# Altium project Diff_Pressure_Sensors.PrjPcb
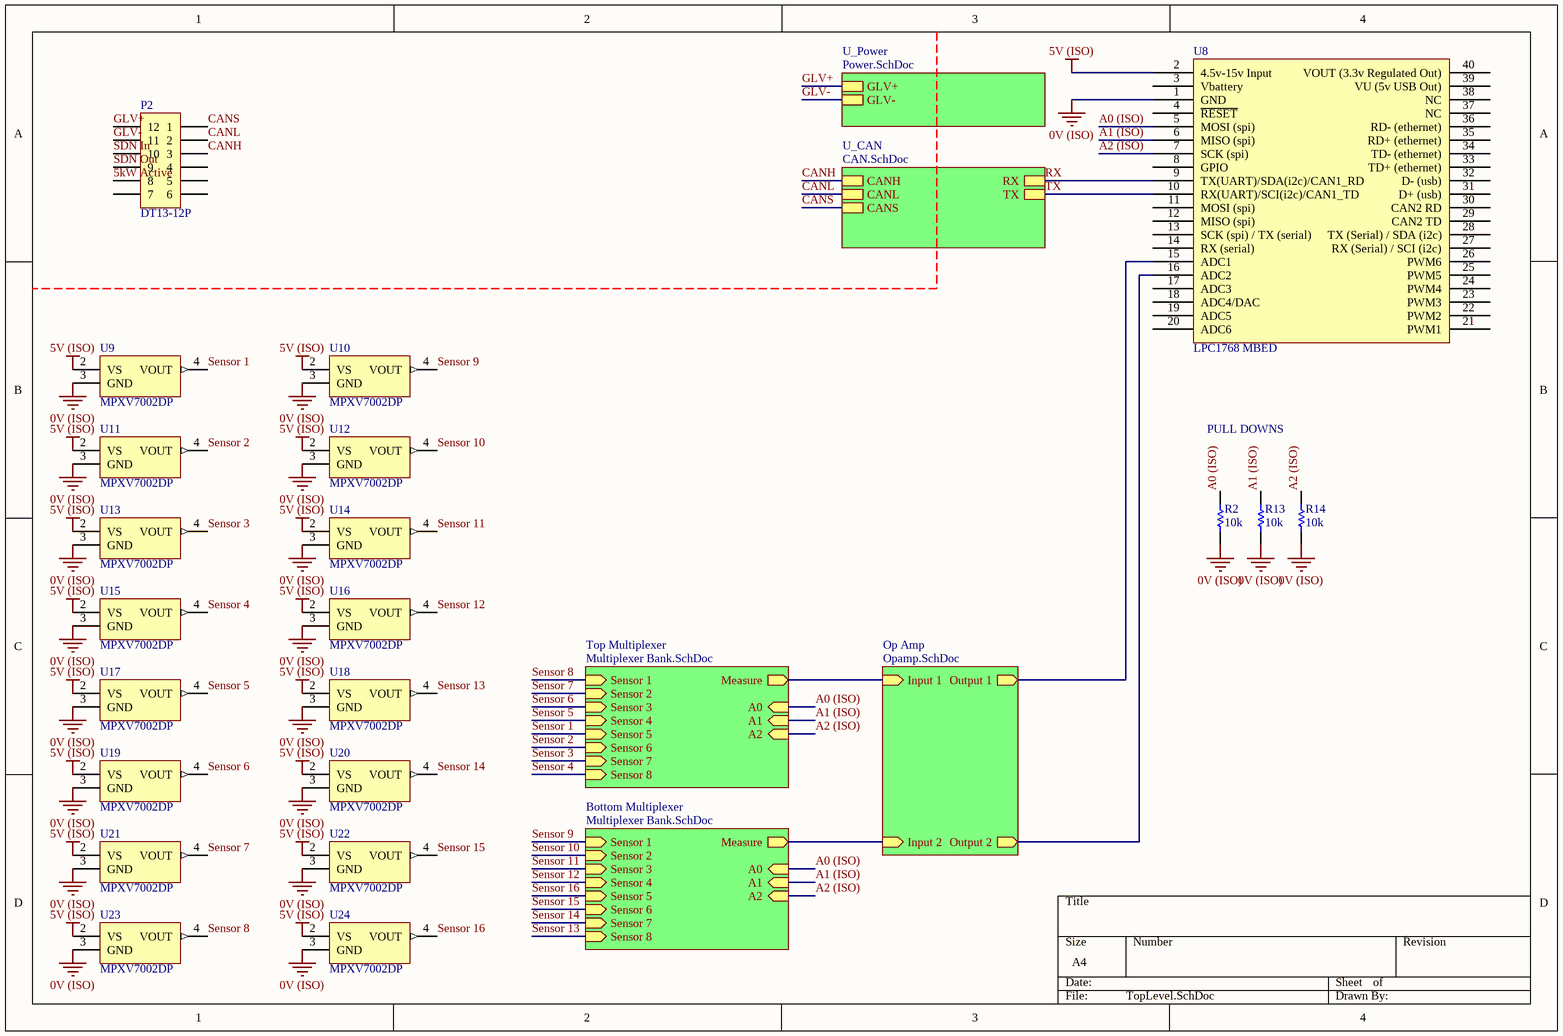
[diagram p0: TopLevel.SchDoc]
5 sheets, 73 parts. Net scope: hierarchical (ports join the sheet entries above them; power ports are global).
Board files: 190830 Diff Pressure Sensors.PcbDoc, 190816 Diff Pressure Sensors.PcbDoc
Sheets:
  TopLevel.SchDoc
    U_Power = Power.SchDoc
    U_CAN = CAN.SchDoc
    Top Multiplexer = Multiplexer Bank.SchDoc
    Bottom Multiplexer = Multiplexer Bank.SchDoc
    Op Amp = Opamp.SchDoc

## Sheet TopLevel.SchDoc
size A4

### Parts
P2  DT13-12P  [DT13-12P]
R2  10k  [0805]
R13  10k  [0805]
R14  10k  [0805]
U8  LPC1768 MBED  [LPC1768 MBED]
U9  MPXV7002DP  [NXP 8-SOP]
U10  MPXV7002DP  [NXP 8-SOP]
U11  MPXV7002DP  [NXP 8-SOP]
U12  MPXV7002DP  [NXP 8-SOP]
U13  MPXV7002DP  [NXP 8-SOP]
U14  MPXV7002DP  [NXP 8-SOP]
U15  MPXV7002DP  [NXP 8-SOP]
U16  MPXV7002DP  [NXP 8-SOP]
U17  MPXV7002DP  [NXP 8-SOP]
U18  MPXV7002DP  [NXP 8-SOP]
U19  MPXV7002DP  [NXP 8-SOP]
U20  MPXV7002DP  [NXP 8-SOP]
U21  MPXV7002DP  [NXP 8-SOP]
U22  MPXV7002DP  [NXP 8-SOP]
U23  MPXV7002DP  [NXP 8-SOP]
U24  MPXV7002DP  [NXP 8-SOP]

### Sub-sheets
Bottom Multiplexer = Multiplexer Bank.SchDoc: Sensor 1 (in), Sensor 2 (in), Sensor 3 (in), Sensor 4 (in), Sensor 5 (in), Sensor 6 (in), Sensor 7 (in), Sensor 8 (in), A0 (in), A1 (in), A2 (in), Measure (out)
Op Amp = Opamp.SchDoc: Input 1 (in), Output 1 (out), Input 2 (in), Output 2 (out)
Top Multiplexer = Multiplexer Bank.SchDoc: Sensor 1 (in), Sensor 2 (in), Sensor 3 (in), Sensor 4 (in), Sensor 5 (in), Sensor 6 (in), Sensor 7 (in), Sensor 8 (in), A0 (in), A1 (in), A2 (in), Measure (out)
U_CAN = CAN.SchDoc: RX, TX, CANH, CANL, CANS
U_Power = Power.SchDoc: GLV+, GLV-

### Nets
0V (ISO): R2.1 R13.1 R14.1 U8.1(GND) U9.3(GND) U10.3(GND) U11.3(GND) U12.3(GND) U13.3(GND) U14.3(GND) U15.3(GND) U16.3(GND) U17.3(GND) U18.3(GND) U19.3(GND) U20.3(GND) U21.3(GND) U22.3(GND) U23.3(GND) U24.3(GND)
5V (ISO): U8.2(4.5v-15v_Input) U9.2(VS) U10.2(VS) U11.2(VS) U12.2(VS) U13.2(VS) U14.2(VS) U15.2(VS) U16.2(VS) U17.2(VS) U18.2(VS) U19.2(VS) U20.2(VS) U21.2(VS) U22.2(VS) U23.2(VS) U24.2(VS)
5kW Active: P2.8
A0 (ISO): R2.2 U8.5(MOSI_(spi)) ; sheet Top Multiplexer/A0, sheet Bottom Multiplexer/A0
A1 (ISO): R13.2 U8.6(MISO_(spi)) ; sheet Top Multiplexer/A1, sheet Bottom Multiplexer/A1
A2 (ISO): R14.2 U8.7(SCK_(spi)) ; sheet Top Multiplexer/A2, sheet Bottom Multiplexer/A2
CANH: P2.3 ; sheet U_CAN/CANH
CANL: P2.2 ; sheet U_CAN/CANL
CANS: P2.1 ; sheet U_CAN/CANS
GLV+: P2.12 ; sheet U_Power/GLV+
GLV-: P2.11 ; sheet U_Power/GLV-
RX: U8.9(TX(UART)/SDA(i2c)/CAN1_RD) ; sheet U_CAN/RX
SDN In: P2.10
SDN Out: P2.9
Sensor 1: U9.4(VOUT) ; sheet Top Multiplexer/Sensor 5
Sensor 2: U11.4(VOUT) ; sheet Top Multiplexer/Sensor 6
Sensor 3: U13.4(VOUT) ; sheet Top Multiplexer/Sensor 7
Sensor 4: U15.4(VOUT) ; sheet Top Multiplexer/Sensor 8
Sensor 5: U17.4(VOUT) ; sheet Top Multiplexer/Sensor 4
Sensor 6: U19.4(VOUT) ; sheet Top Multiplexer/Sensor 3
Sensor 7: U21.4(VOUT) ; sheet Top Multiplexer/Sensor 2
Sensor 8: U23.4(VOUT) ; sheet Top Multiplexer/Sensor 1
Sensor 9: U10.4(VOUT) ; sheet Bottom Multiplexer/Sensor 1
Sensor 10: U12.4(VOUT) ; sheet Bottom Multiplexer/Sensor 2
Sensor 11: U14.4(VOUT) ; sheet Bottom Multiplexer/Sensor 3
Sensor 12: U16.4(VOUT) ; sheet Bottom Multiplexer/Sensor 4
Sensor 13: U18.4(VOUT) ; sheet Bottom Multiplexer/Sensor 8
Sensor 14: U20.4(VOUT) ; sheet Bottom Multiplexer/Sensor 7
Sensor 15: U22.4(VOUT) ; sheet Bottom Multiplexer/Sensor 6
Sensor 16: U24.4(VOUT) ; sheet Bottom Multiplexer/Sensor 5
TX: U8.10(RX(UART)/SCI(i2c)/CAN1_TD) ; sheet U_CAN/TX
NetR11_1: U8.15(ADC1) ; sheet Op Amp/Output 1
NetR15_1: U8.16(ADC2) ; sheet Op Amp/Output 2
NetU4_Bottom_Multiplexer_8: sheet Bottom Multiplexer/Measure, sheet Op Amp/Input 2
NetU4_Top_Multiplexer_8: sheet Top Multiplexer/Measure, sheet Op Amp/Input 1

Not connected (* = marked no-connect by the designer): P2 4 5 6 7; U8 3(Vbattery) 4(~{RESET}) 8(GPIO) 11(MOSI_(spi)) 12(MISO_(spi)) 13(SCK_(spi)_/_TX_(serial)) 14(RX_(serial)) 17(ADC3) 18(ADC4/DAC) 19(ADC5) 20(ADC6) 21(PWM1) 22(PWM2) 23(PWM3) 24(PWM4) 25(PWM5) 26(PWM6) 27(RX_(Serial)_/_SCI_(i2c)) 28(TX_(Serial)_/_SDA_(i2c)) 29(CAN2_TD) 30(CAN2_RD) 31(D+_(usb)) 32(D-_(usb)) 33(TD+_(ethernet)) 34(TD-_(ethernet)) 35(RD+_(ethernet)) 36(RD-_(ethernet)) 37(NC) 38(NC) 39(VU_(5v_USB_Out)) 40(VOUT_(3.3v_Regulated_Out))

### Notes on the sheet
- PULL DOWNS

### Library data of the parts
P2 = DT13-12P[[/\]]DT13-12P: Positions: 12; Pitch: 4.44mm; Row Spacing: 6.35mm; Angle: 90; Flange: Yes; Contact: Nickel; Part Number: DT13-12P; Digikey Part Number: 1734-1451-ND; Digikey Link: https://www.digikey.com.au/product-detail/en/te-connectivity-deutsch-connectors/DT13-12PA/1734-1451-ND/7220123
R2 R13 R14 = RC0805FR0710KL: Manufacturer: YAGEO; Tolerance: 0.01; Rated Voltage: 0.125W; Part Number: RC0805FR0710KL; Value: 10k; Material: FR-07; qty: 50
U8 = LPC1768 MBED: ARM M3 mBed Enabled Microcontroller; Manufacturer: NXP; Part Number: LPC1768 MBED; Digikey Part Number: 568-4916-ND; Digikey Link: https://www.digikey.com/product-detail/en/nxp-usa-inc/OM11043,598/568-4916-ND/2138502
U9-U24 = MPXV7002DP: Pressure Sensor ±0.29PSI (±2kPa) Differential Male - 0.13" (3.3mm) Tube, Dual 0.5 V ~ 4.5 V 8-BSOP (0.475", 12.06mm Width) Dual Ports, Same Side; Manufacturer: NXP; Part Number: MPXV7002DP; Digikey Part Number: MPXV7002DP-ND; Digikey Link: https://www.digikey.com.au/product-detail/en/nxp-usa-inc/MPXV7002DP/MPXV7002DP-ND/1168436?fbclid=IwAR0MQZl90cLpuihBZbsL3GvMnSHGSbwsdkIDRrDTi8UoGVz_88UawI4CY1w

## Sheet Power.SchDoc
size A4
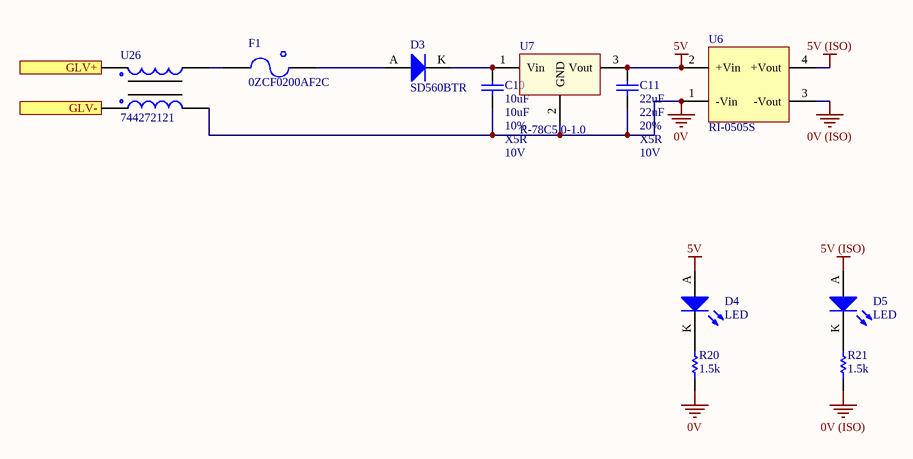
[diagram p1: Power.SchDoc]

### Parts
C10  10uF  Tolerance: 10%  Material: X5R  Rated Voltage: 10V  [0805]
C11  22uF  Tolerance: 20%  Material: X5R  Rated Voltage: 10V  [0805]
D3  SD560BTR  [SMB Diode]
D4  LED  [0805 LED]
D5  LED  [0805 LED]
F1  0ZCF0200AF2C  [2920]
R20  1.5k  [0805]
R21  1.5k  [0805]
U6  RI-0505S  [RECOM 4-SIP]
U7  R-78C5.0-1.0  [RECOM 3-SIP]
U26  744272121  [Wurth 4-PC Pad]

### Ports
GLV+, GLV-

### Nets
0V: C10.1 C11.1 R20.1 U6.1(-Vin) U7.2(GND) U26.3
0V (ISO): R21.1 U6.3(-Vout)
5V: C11.2 D4.A U6.2(+Vin) U7.3(Vout)
5V (ISO): D5.A U6.4(+Vout)
GLV+: U26.1 ; port GLV+
GLV-: U26.4 ; port GLV-
NetC10_2: C10.2 D3.K U7.1(Vin)
NetD3_A: D3.A F1.2
NetD4_K: D4.K R20.2
NetD5_K: D5.K R21.2
NetF1_1: F1.1 U26.2

### Library data of the parts
C10 = GCM21BR61A106KA37L: Manufacturer: muRata; Value: 10uF; Part Number: GCM21BR61A106KA37L
C11 = GRM21BR61A226ME51L: Manufacturer: muRata; Value: 22uF; Digikey Part Number: 490-10511-1-ND; Part Number: GRM21BR61A226ME51L
D3 = SD560BTR: 1.2V_F 600V 5A SMB; Manufacturer: SMC Diode Solutions; Part Number: SD560BTR; Digikey Part Number: 1655-1530-2-ND; Digikey Link: https://www.digikey.com/product-detail/en/smc-diode-solutions/SD560BTR/1655-1530-2-ND/6022620
D4 D5 = SML-210LTT86: Red LED Indication - Discrete 1.75V 0805 (2012 Metric); Manufacturer: ROHM Semiconductor; Part Number: SML-210LTT86; Colour: Red; Digikey Part Number: 511-1286-1-ND; Digikey Link: https://www.digikey.com/product-detail/en/rohm-semiconductor/SML-210LTT86/511-1286-1-ND/637099
F1 = 0ZCF0200AF2C: SMD 24V 2A Fuse; Manufacturer: Bel Fuse Inc; Part Number: 0ZCF0200AF2C; Digikey Part Number: 507-1749-2-ND; Digikey Link: https://www.digikey.com/product-detail/en/bel-fuse-inc/0ZCF0200AF2C/507-1749-2-ND/4156090
R20 R21 = RC0805FR071K5L: Manufacturer: YAGEO; Tolerance: 0.01; Rated Voltage: 0.125W; Part Number: RC0805FR071K5L; Value: 1.5k; Material: FR-07; qty: 50
U6 = RI-0505S: 5V DC-DC Converter (2W); Manufacturer: Recom; Part Number: RI-0505S; Digikey Part Number: 945-1189-ND; Digikey Link: https://www.digikey.com/product-detail/en/recom-power/RI-0505S/945-1189-ND/2256369
U7 = R-78C5.0-1.0: CONV DC/DC 1A 5V OUT SIP VERT; Manufacturer: Recom; Part Number: R-78C5.0-1.0; Digikey Part Number: 945-1395-5-ND; Digikey Link: https://www.digikey.com.au/product-detail/en/recom-power/R-78C5.0-1.0/945-1395-5-ND/2652148
U26 = 744272121: Common Mode Choke 120UH 2.5A 2LN 460 OHM SMD; Manufacturer: Wurth Electronics Inc; Part Number: 744272121; Digikey Part Number: 732-1489-2-ND; Digikey Link: https://www.digikey.com/product-detail/en/wurth-electronics-inc/744272121/732-1489-2-ND/1638893

## Sheet CAN.SchDoc
size A4
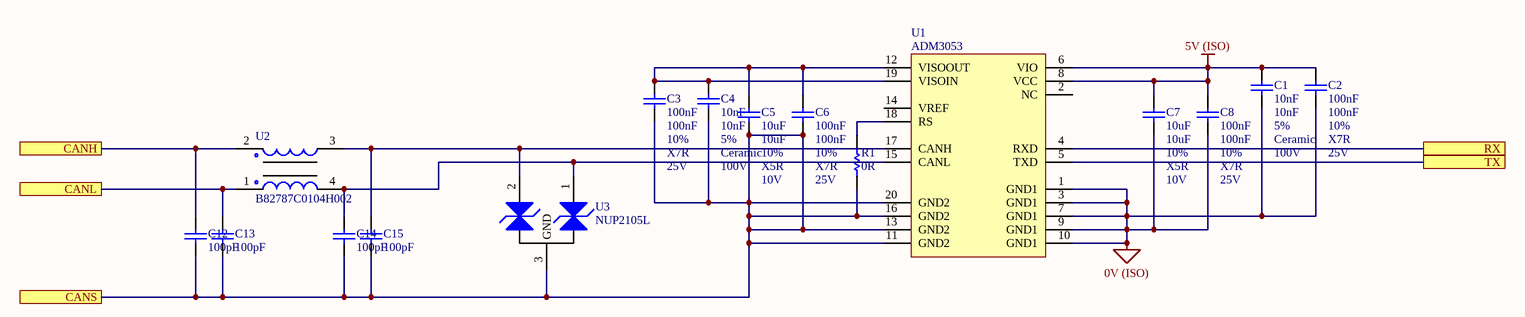
[diagram p2: CAN.SchDoc]

### Parts
C1  10nF  Tolerance: 5%  Material: Ceramic  Rated Voltage: 100V  [1206]
C2  100nF  Tolerance: 10%  Material: X7R  Rated Voltage: 25V  [0805]
C3  100nF  Tolerance: 10%  Material: X7R  Rated Voltage: 25V  [0805]
C4  10nF  Tolerance: 5%  Material: Ceramic  Rated Voltage: 100V  [1206]
C5  10uF  Tolerance: 10%  Material: X5R  Rated Voltage: 10V  [0805]
C6  100nF  Tolerance: 10%  Material: X7R  Rated Voltage: 25V  [0805]
C7  10uF  Tolerance: 10%  Material: X5R  Rated Voltage: 10V  [0805]
C8  100nF  Tolerance: 10%  Material: X7R  Rated Voltage: 25V  [0805]
C12  100pF  [0805]
C13  100pF  [0805]
C14  100pF  [0805]
C15  100pF  [0805]
R1  0R  [0805]
U1  ADM3053  [AD SOIC-W 20]
U2  B82787C0104H002  [TDK 4-PC Pad]
U3  NUP2105L  [ON SOT-23]

### Ports
CANH, CANL, CANS, RX, TX

### Nets
0V (ISO): C1.1 C2.1 C7.1 C8.1 U1.1(GND1) U1.3(GND1) U1.7(GND1) U1.9(GND1) U1.10(GND1)
5V (ISO): C1.2 C2.2 C7.2 C8.2 U1.6(VIO) U1.8(VCC)
CANH: C12.2 U2.2 ; port CANH
CANL: C13.2 U2.1 ; port CANL
CANS: C3.1 C4.1 C5.1 C6.1 C12.1 C13.1 C14.1 C15.1 R1.1 U1.11(GND2) U1.13(GND2) U1.16(GND2) U1.20(GND2) U3.3(GND) ; port CANS
RX: U1.4(RXD) ; port RX
TX: U1.5(TXD) ; port TX
NetC3_2: C3.2 C4.2 C5.2 C6.2 U1.12(VISOOUT) U1.19(VISOIN)
NetC14_2: C14.2 U1.15(CANL) U2.4 U3.1(CAN_H)
NetC15_2: C15.2 U1.17(CANH) U2.3 U3.2(CAN_L)
NetR1_2: R1.2 U1.18(RS)

Not connected (* = marked no-connect by the designer): U1 2(NC) 14(VREF)

### Notes on the sheet
- (in symbol RC0805FR070RL) 0805

### Library data of the parts
C1 C4 = GCM3195C2A103JA16D: Manufacturer: muRata; Value: 10nF; Part Number: GCM3195C2A103JA16D; Digikey Part Number: 490-4978-2-ND
C2 C3 C6 C8 = GCM21BR71E104KA37L: Manufacturer: muRata; Value: 100nF; Part Number: GCM21BR71E104KA37L
C5 C7 = GCM21BR61A106KA37L: Manufacturer: muRata; Value: 10uF; Part Number: GCM21BR61A106KA37L
C12-C15 = GCM21B5C1H101JA37L: Manufacturer: muRata; Tolerance: 5%; Material: C0G; Rated Voltage: 50V; Part Number: GCM21B5C1H101JA37L; Value: 100pF
R1 = RC0805FR070RL: Manufacturer: YAGEO; Tolerance: 0.01; Rated Voltage: 0.125W; Value: 0R; Part Number: RC0805FR070RL; Material: FR-07; qty: 50
U1 = ADM3053: Isolated CAN Transceiver; Manufacturer: Analogue Devices; Part Number: ADM3053; Digikey Part Number: ADM3053BRWZ-ND; Digikey Link: https://www.digikey.com/product-detail/en/analog-devices-inc/ADM3053BRWZ/ADM3053BRWZ-ND/2709332
U2 = B82787C0104H002: Common mode choke intended for CANBUS 150mA 50V); Manufacturer: EPCOS (TDK); Part Number: B82787C0104H002; Digikey Part Number: 495-4598-2-ND; Digikey Link: https://www.digikey.com/product-detail/en/epcos-tdk/B82787C0104H002/495-4598-2-ND/3680998
U3 = NUP2105L: Dual Line CAN Bus Protector; Manufacturer: ON Semiconductor; Part Number: NUP2105L; Type: CAN ESD Protection; Digikey Part Number: NUP2105LT1GOSCT-ND; Digikey Link: https://www.digikey.com/product-detail/en/on-semiconductor/NUP2105LT1G/NUP2105LT1GOSCT-ND/1485001

## Sheet Multiplexer Bank.SchDoc
size A4
Used 2 times, as channels Top Multiplexer, Bottom Multiplexer. Parts and nets are listed once, with the designators drawn on the sheet.
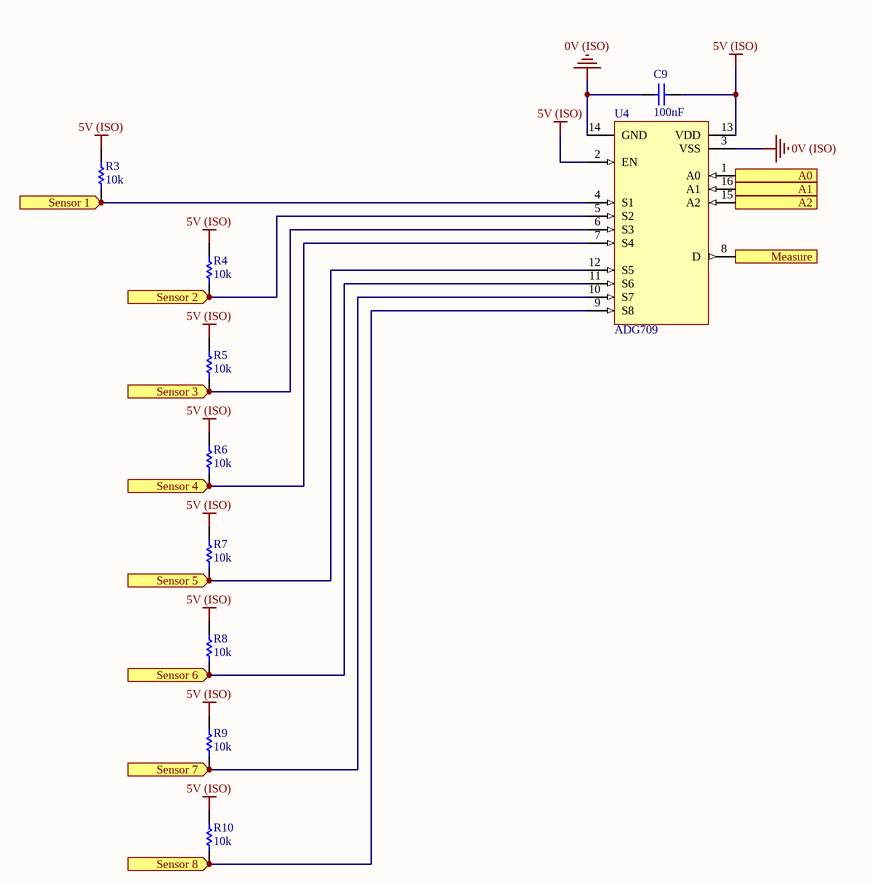
[diagram p3: Multiplexer Bank.SchDoc]

### Parts
C9  100nF  Tolerance: 10%  Material: X7R  Rated Voltage: 25V  [0805]
R3  10k  [0805]
R4  10k  [0805]
R5  10k  [0805]
R6  10k  [0805]
R7  10k  [0805]
R8  10k  [0805]
R9  10k  [0805]
R10  10k  [0805]
U4  ADG709  [AD 16-TSSOP]

### Ports
A0 (in), A1 (in), A2 (in), Measure (out), Sensor 1 (in), Sensor 2 (in), Sensor 3 (in), Sensor 4 (in), Sensor 5 (in), Sensor 6 (in), Sensor 7 (in), Sensor 8 (in)

### Nets
0V (ISO): C9.1 U4.3(VSS) U4.14(GND)
5V (ISO): C9.2 R3.2 R4.2 R5.2 R6.2 R7.2 R8.2 R9.2 R10.2 U4.2(EN) U4.13(VDD)
A0: U4.1(A0) ; port A0
A1: U4.16(A1) ; port A1
A2: U4.15(A2) ; port A2
Measure: U4.8(D) ; port Measure
Sensor 1: R3.1 U4.4(S1) ; port Sensor 1
Sensor 2: R4.1 U4.5(S2) ; port Sensor 2
Sensor 3: R5.1 U4.6(S3) ; port Sensor 3
Sensor 4: R6.1 U4.7(S4) ; port Sensor 4
Sensor 5: R7.1 U4.12(S5) ; port Sensor 5
Sensor 6: R8.1 U4.11(S6) ; port Sensor 6
Sensor 7: R9.1 U4.10(S7) ; port Sensor 7
Sensor 8: R10.1 U4.9(S8) ; port Sensor 8

### Channels
Top Multiplexer: designators end in _Top_Multiplexer; ports A0=A0 (ISO) A1=A1 (ISO) A2=A2 (ISO) Measure=NetU4_Top_Multiplexer_8 Sensor 1=Sensor 8 Sensor 2=Sensor 7 Sensor 3=Sensor 6 Sensor 4=Sensor 5 Sensor 5=Sensor 1 Sensor 6=Sensor 2 Sensor 7=Sensor 3 Sensor 8=Sensor 4
Bottom Multiplexer: designators end in _Bottom_Multiplexer; ports A0=A0 (ISO) A1=A1 (ISO) A2=A2 (ISO) Measure=NetU4_Bottom_Multiplexer_8 Sensor 1=Sensor 9 Sensor 2=Sensor 10 Sensor 3=Sensor 11 Sensor 4=Sensor 12 Sensor 5=Sensor 16 Sensor 6=Sensor 15 Sensor 7=Sensor 14 Sensor 8=Sensor 13

### Library data of the parts
C9 = GCM21BR71E104KA37L: Manufacturer: muRata; Value: 100nF; Part Number: GCM21BR71E104KA37L
R3-R10 = RC0805FR0710KL: as R2 on sheet TopLevel; Part Number: RC0805FR0710KL; Value: 10k; Material: FR-07; qty: 50
U4 = ADG709: 2 Circuit IC Switch 4:1 4.5 Ohm 16-TSSOP; Manufacturer: Analogue Devices; Part Number: ADG709; Digikey Part Number: ADG709CRUZ-REEL7TR-ND; Digikey Link: https://www.digikey.com/product-detail/en/analog-devices-inc/ADG709CRUZ-REEL7/ADG709CRUZ-REEL7TR-ND/995219

## Sheet Opamp.SchDoc
size A4; Organization: Altium Limited; Address1: L3, 12a Rodborough Rd; Address2: Frenchs Forest; Address3: NSW; Address4: Australia 2086
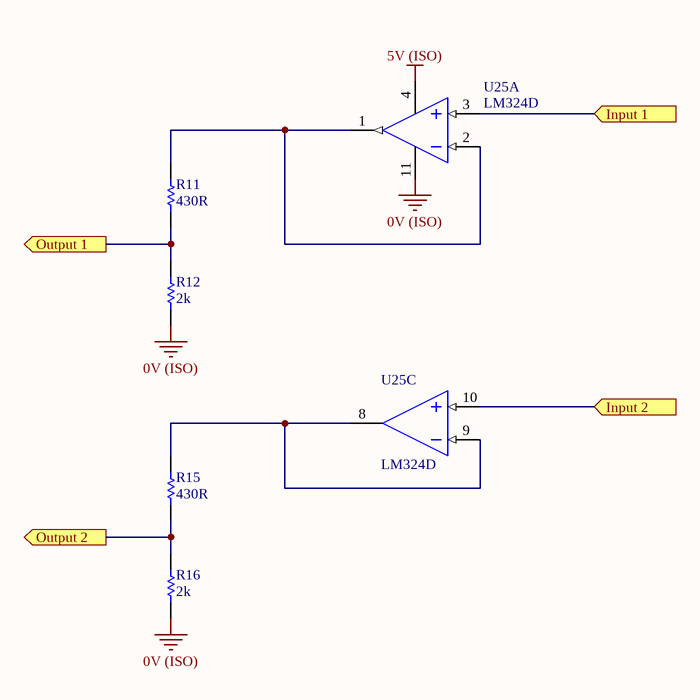
[diagram p4: Opamp.SchDoc]

### Parts
R11  430R  [0805]
R12  2k  [0805]
R15  430R  [0805]
R16  2k  [0805]
U25  LM324D  [TI 14-SOIC]  (parts A,C of 4)

### Ports
Input 1 (in), Input 2 (in), Output 1 (out), Output 2 (out)

### Nets
0V (ISO): R12.1 R16.1 U25.11(GND)
5V (ISO): U25.4(VCC)
NetR11_1: R11.1 R12.2 ; port Output 1
NetR11_2: R11.2 U25.1(1OUT) U25.2(1IN+)
NetR15_1: R15.1 R16.2 ; port Output 2
NetR15_2: R15.2 U25.8(3OUT) U25.9(3IN-)
NetU4_Bottom_Multiplexer_8: U25.10(3IN+) ; port Input 2
NetU4_Top_Multiplexer_8: U25.3(1IN+) ; port Input 1

### Notes on the sheet
- Title
- Size:
- Date:
- A4
- Number:
- Time:
- Revision:
- Sheet
- of
- File:

### Library data of the parts
R11 R15 = RC0805FR07430RL: Manufacturer: YAGEO; Tolerance: 0.01; Rated Voltage: 0.125W; Part Number: RC0805FR07430RL; Value: 430R; Material: FR-07; qty: 50
R12 R16 = RC0805FR072KL: Manufacturer: YAGEO; Tolerance: 0.01; Rated Voltage: 0.125W; Part Number: RC0805FR072KL; Value: 2k; Material: FR-07; qty: 50
U25 = LM324D: IC OPAMP GP 4 CIRCUIT 14SOIC; Manufacturer: Texas Instruments; Part Number: LM324D; Digikey Part Number: 296-1390-5-ND; Digikey Link: https://www.digikey.com/product-detail/en/texas-instruments/LM324D/296-1390-5-ND/277039

## Nets that join several sheets
0V (ISO): TopLevel (20 pins), Power (R21.1 U6.3), CAN (9 pins), Top Multiplexer (C9_Top_Multiplexer.1 U4_Top_Multiplexer.3 U4_Top_Multiplexer.14), Bottom Multiplexer (C9_Bottom_Multiplexer.1 U4_Bottom_Multiplexer.3 U4_Bottom_Multiplexer.14), Opamp (R12.1 R16.1 U25.11)
5V (ISO): TopLevel (17 pins), Power (D5.A U6.4), CAN (6 pins), Top Multiplexer (11 pins), Bottom Multiplexer (11 pins), Opamp (U25.4)
A0 (ISO): TopLevel (R2.2 U8.5), Top Multiplexer (U4_Top_Multiplexer.1), Bottom Multiplexer (U4_Bottom_Multiplexer.1)
A1 (ISO): TopLevel (R13.2 U8.6), Top Multiplexer (U4_Top_Multiplexer.16), Bottom Multiplexer (U4_Bottom_Multiplexer.16)
A2 (ISO): TopLevel (R14.2 U8.7), Top Multiplexer (U4_Top_Multiplexer.15), Bottom Multiplexer (U4_Bottom_Multiplexer.15)
CANH: TopLevel (P2.3), CAN (C12.2 U2.2)
CANL: TopLevel (P2.2), CAN (C13.2 U2.1)
CANS: TopLevel (P2.1), CAN (14 pins)
GLV+: TopLevel (P2.12), Power (U26.1)
GLV-: TopLevel (P2.11), Power (U26.4)
NetR11_1: TopLevel (U8.15), Opamp (R11.1 R12.2)
NetR15_1: TopLevel (U8.16), Opamp (R15.1 R16.2)
NetU4_Bottom_Multiplexer_8: Bottom Multiplexer (U4_Bottom_Multiplexer.8), Opamp (U25.10)
NetU4_Top_Multiplexer_8: Top Multiplexer (U4_Top_Multiplexer.8), Opamp (U25.3)
RX: TopLevel (U8.9), CAN (U1.4)
Sensor 1: TopLevel (U9.4), Top Multiplexer (R7_Top_Multiplexer.1 U4_Top_Multiplexer.12)
Sensor 2: TopLevel (U11.4), Top Multiplexer (R8_Top_Multiplexer.1 U4_Top_Multiplexer.11)
Sensor 3: TopLevel (U13.4), Top Multiplexer (R9_Top_Multiplexer.1 U4_Top_Multiplexer.10)
Sensor 4: TopLevel (U15.4), Top Multiplexer (R10_Top_Multiplexer.1 U4_Top_Multiplexer.9)
Sensor 5: TopLevel (U17.4), Top Multiplexer (R6_Top_Multiplexer.1 U4_Top_Multiplexer.7)
Sensor 6: TopLevel (U19.4), Top Multiplexer (R5_Top_Multiplexer.1 U4_Top_Multiplexer.6)
Sensor 7: TopLevel (U21.4), Top Multiplexer (R4_Top_Multiplexer.1 U4_Top_Multiplexer.5)
Sensor 8: TopLevel (U23.4), Top Multiplexer (R3_Top_Multiplexer.1 U4_Top_Multiplexer.4)
Sensor 9: TopLevel (U10.4), Bottom Multiplexer (R3_Bottom_Multiplexer.1 U4_Bottom_Multiplexer.4)
Sensor 10: TopLevel (U12.4), Bottom Multiplexer (R4_Bottom_Multiplexer.1 U4_Bottom_Multiplexer.5)
Sensor 11: TopLevel (U14.4), Bottom Multiplexer (R5_Bottom_Multiplexer.1 U4_Bottom_Multiplexer.6)
Sensor 12: TopLevel (U16.4), Bottom Multiplexer (R6_Bottom_Multiplexer.1 U4_Bottom_Multiplexer.7)
Sensor 13: TopLevel (U18.4), Bottom Multiplexer (R10_Bottom_Multiplexer.1 U4_Bottom_Multiplexer.9)
Sensor 14: TopLevel (U20.4), Bottom Multiplexer (R9_Bottom_Multiplexer.1 U4_Bottom_Multiplexer.10)
Sensor 15: TopLevel (U22.4), Bottom Multiplexer (R8_Bottom_Multiplexer.1 U4_Bottom_Multiplexer.11)
Sensor 16: TopLevel (U24.4), Bottom Multiplexer (R7_Bottom_Multiplexer.1 U4_Bottom_Multiplexer.12)
TX: TopLevel (U8.10), CAN (U1.5)